# EAGLE schematic LightsPCB (EAGLE 9.5.2)
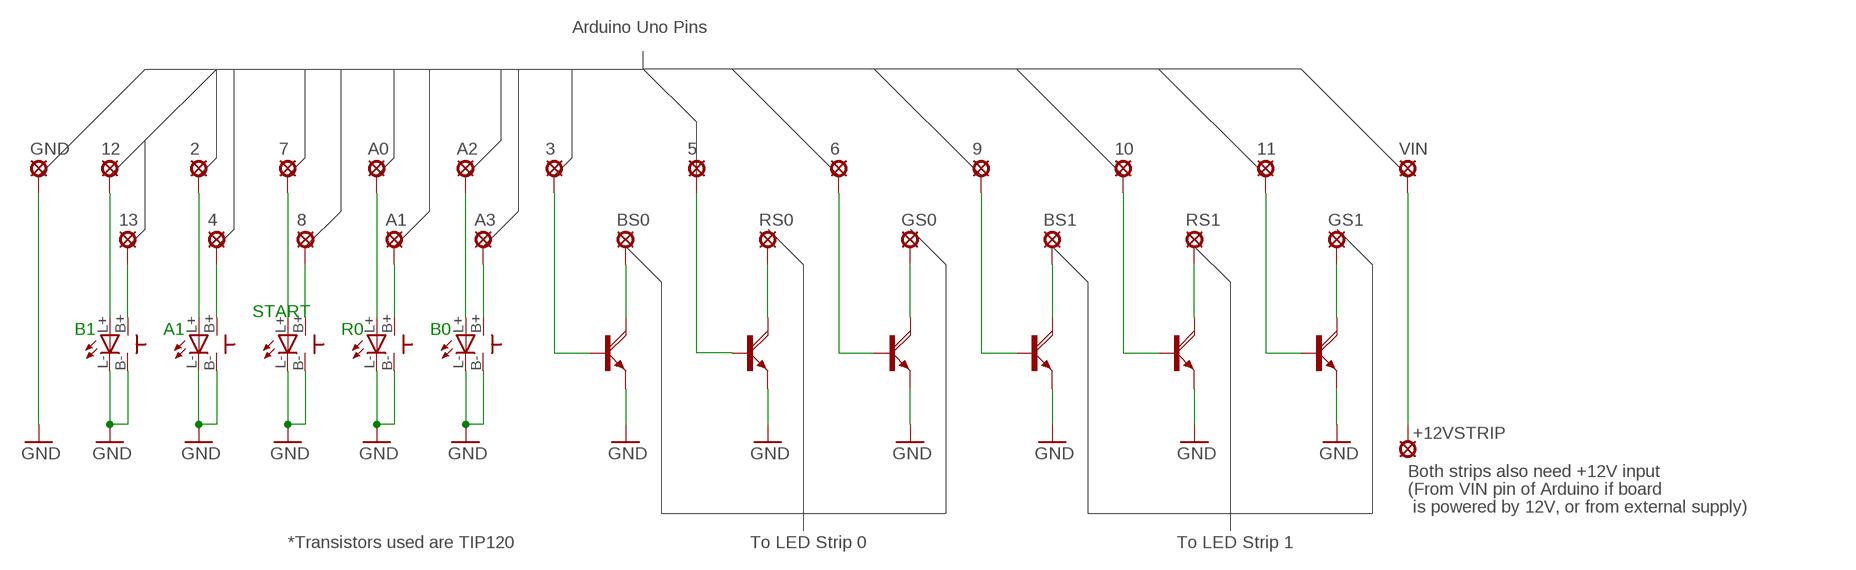
[diagram p0: schematic, sheet 1]

## Parts
2  LSP10  [LSP10]
3  LSP10  [LSP10]
4  LSP10  [LSP10]
5  LSP10  [LSP10]
6  LSP10  [LSP10]
7  LSP10  [LSP10]
8  LSP10  [LSP10]
9  LSP10  [LSP10]
10  LSP10  [LSP10]
11  LSP10  [LSP10]
12  LSP10  [LSP10]
13  LSP10  [LSP10]
+12VSTRIP  LSP10  [LSP10]
A0  LSP10  [LSP10]
A1  LSP10  [LSP10]
A2  LSP10  [LSP10]
A3  LSP10  [LSP10]
B0  LEDBUTTON  [LEDBUTTON]
B1  LEDBUTTON  [LEDBUTTON]
BS0  LSP10  [LSP10]
BS1  LSP10  [LSP10]
GND  LSP10  [LSP10]
GS0  LSP10  [LSP10]
GS1  LSP10  [LSP10]
R0  LEDBUTTON  [LEDBUTTON]
R1  LEDBUTTON  [LEDBUTTON]
RS0  LSP10  [LSP10]
RS1  LSP10  [LSP10]
START  LEDBUTTON  [LEDBUTTON]
U1  TIP120  [TO220AH]
U2  TIP120  [TO220AH]
U3  TIP120  [TO220AH]
U4  TIP120  [TO220AH]
U5  TIP120  [TO220AH]
U6  TIP120  [TO220AH]
VIN  LSP10  [LSP10]

## Nets
B1BUTT: A3.MP B0.B+
B1LED: A2.MP B0.L+
B2BUTT: 13.MP B1.B+
B2LED: 12.MP B1.L+
BTOSTRIP: BS0.MP U1.C
BTOSTRIP1: BS1.MP U5.C
GND: B0.B- B0.L- B1.B- B1.L- GND.MP R0.B- R0.L- R1.B- R1.L- START.B- START.L- U1.E U2.E U3.E U4.E U5.E U6.E
GTOSTRIP: GS0.MP U3.C
GTOSTRIP1: GS1.MP U6.C
N$1: 3.MP U1.B
N$2: 5.MP U2.B
N$3: 6.MP U3.B
N$4: 9.MP U5.B
N$5: 10.MP U4.B
N$6: 11.MP U6.B
N$7: RS1.MP U4.C
R1BUTT: A1.MP R0.B+
R1LED: A0.MP R0.L+
R2BUTT: 4.MP R1.B+
R2LED: 2.MP R1.L+
RTOSTRIP: RS0.MP U2.C
STARTLED: 7.MP START.L+
STRTBUTT: 8.MP START.B+
VIN: +12VSTRIP.MP VIN.MP

## Notes on the sheet
- Arduino Uno Pins
- START
- B1 | A1 | R0 | B0
- Both strips also need +12V input
- (From VIN pin of Arduino if board
- is powered by 12V, or from external supply)
- *Transistors used are TIP120 | To LED Strip 0 | To LED Strip 1

## Library data of the parts
2-13 +12VSTRIP A0 A1-A3 BS0 BS1 GND GS0 GS1 RS0 RS1 VIN = solpad:LSP10: SOLDER PAD drill 1.0 mm, distributor Buerklin, 12H555
B0 B1 R0 R1 START = USIRC:LEDBUTTON
U1-U6 = transistor-power:TIP120: NPN DARLINGTON TRANSISTOR

## Net classes
0 default: clearance 0.205 mm